# EAGLE design Zvonek (EAGLE 9.5.2)
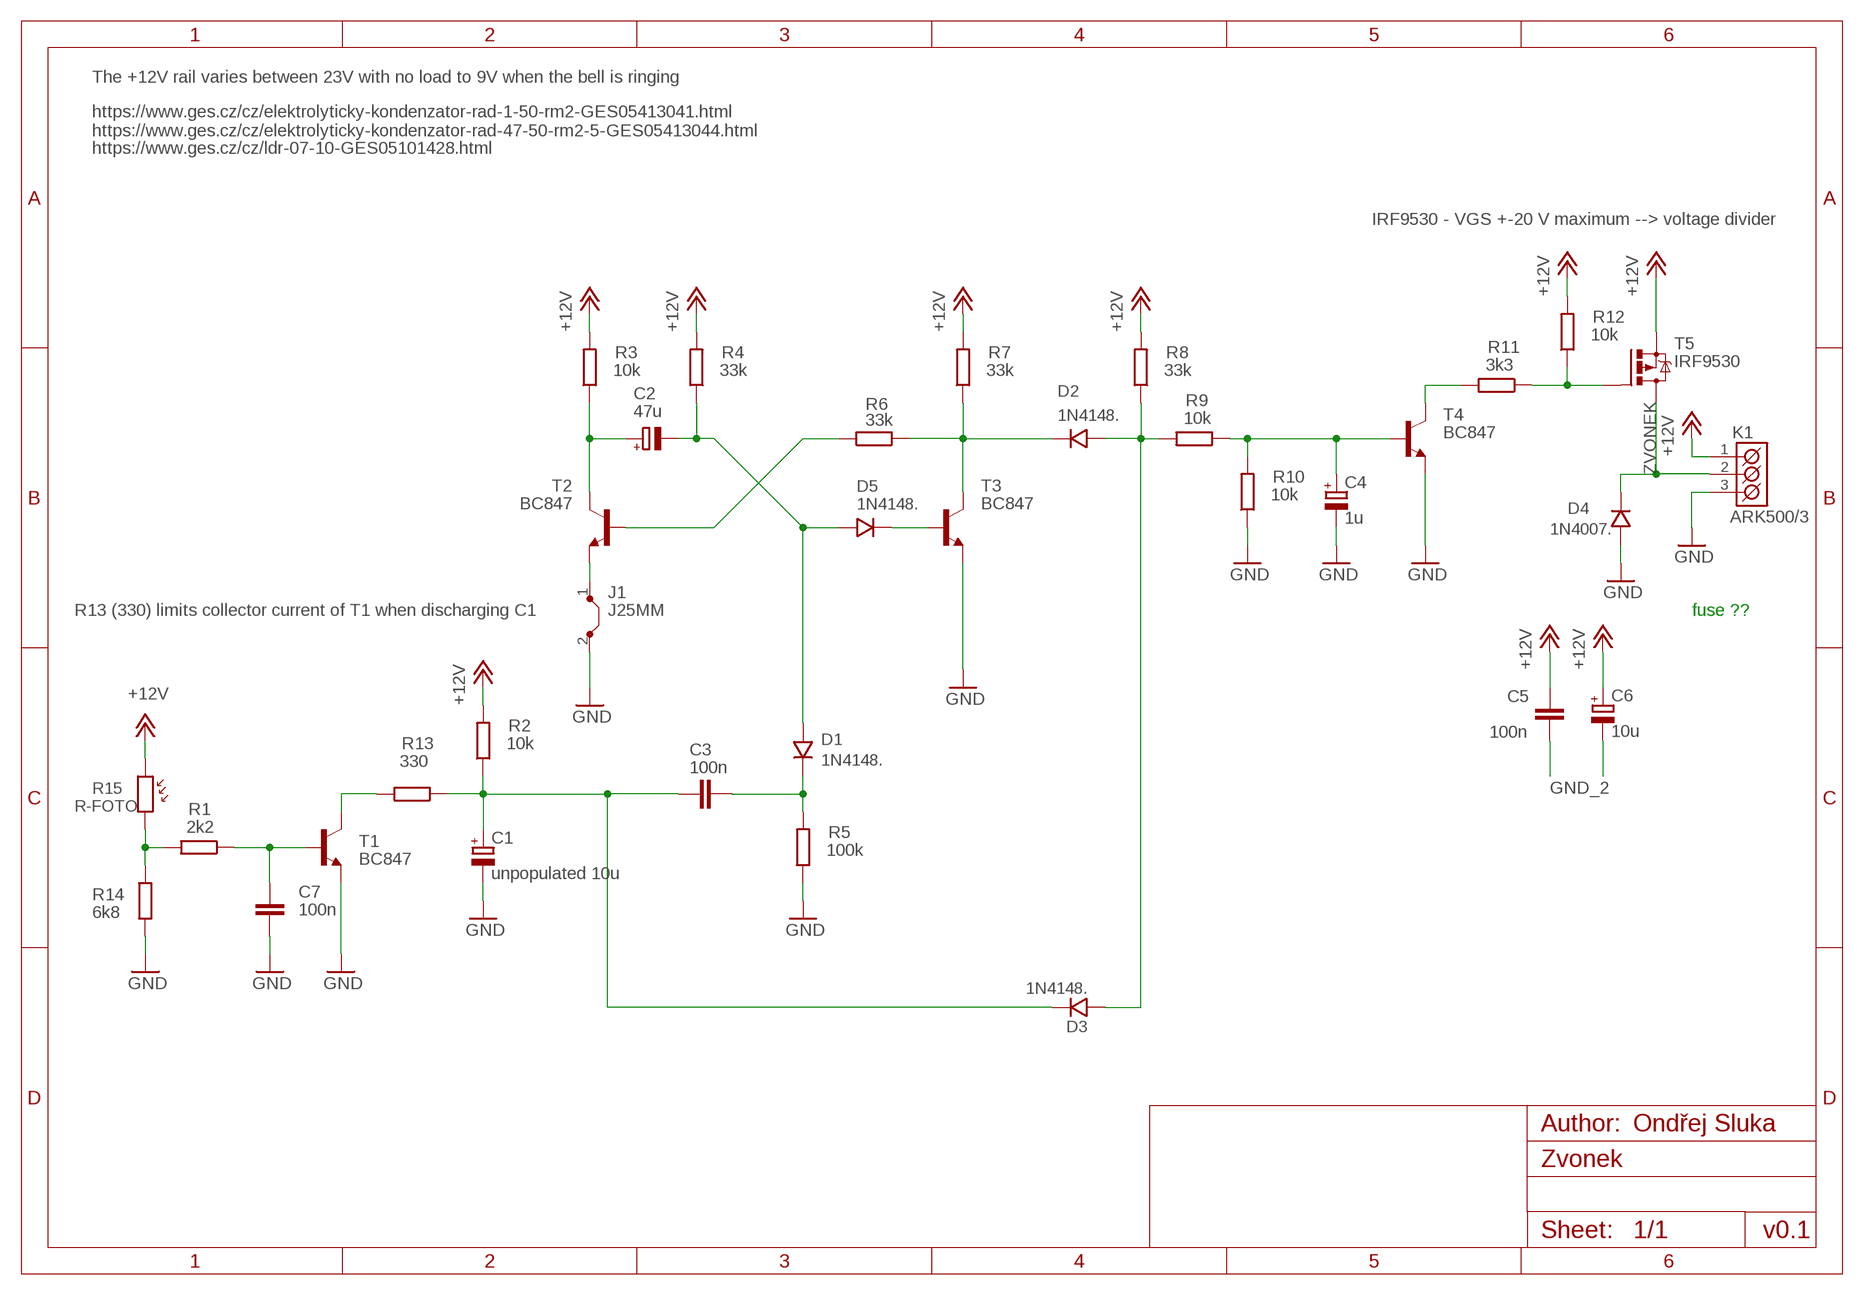
[diagram p0: schematic, sheet 1]
FRAME1 (A4L-LOC): AUTHOR: Ondřej Sluka; VERSION: v0.1

## Parts
C1  unpopulated 10u  CPOL-EUE2.5-5  [E2,5-5]
C2  47u  CPOL-EUE2.5-6  [E2,5-6]
C3  100n  C-EUC1206  [C1206]
C4  1u  CPOL-EUE2-5  [E2-5]
C5  100n  C-EUC1206  [C1206]
C6  10u  CPOL-EUE2.5-5  [E2,5-5]
C7  100n  C-EUC1206  [C1206]
D1  1N4148.  [SOD-80]
D2  1N4148.  [SOD-80]
D3  1N4148.  [SOD-80]
D4  1N4007.  [SM-1]
D5  1N4148.  [SOD-80]
J1  J25MM  [25]
K1  ARK500/3  [ARK500/3]
R1  2k2  R-EU_R1206  [R1206]
R2  10k  R-EU_R1206  [R1206]
R3  10k  R-EU_R1206  [R1206]
R4  33k  R-EU_R1206  [R1206]
R5  100k  R-EU_R1206  [R1206]
R6  33k  R-EU_R1206  [R1206]
R7  33k  R-EU_R1206  [R1206]
R8  33k  R-EU_R1206  [R1206]
R9  10k  R-EU_R1206  [R1206]
R10  10k  R-EU_R1206  [R1206]
R11  3k3  R-EU_R1206  [R1206]
R12  10k  R-EU_R1206  [R1206]
R13  330  R-EU_R1206  [R1206]
R14  6k8  R-EU_R1206  [R1206]
R15  R-FOTO  [R-FOTO]
T1  BC847  [SOT23]
T2  BC847  [SOT23]
T3  BC847  [SOT23]
T4  BC847  [SOT23]
T5  IRF9530  [TO220BV]

## Nets
+12V: C5.2 C6.+ K1.1(K1) R2.2 R3.2 R4.2 R7.2 R8.2 R12.2 R15.1 T5.S
GND: C1.- C4.- C7.1 D4.A J1.2 K1.3(K3) R5.1 R10.1 R14.2 T1.2(E) T3.2(E) T4.2(E)
GND_2: C5.1 C6.- J1.1 T2.2(E)
N$1: D2.K R6.2 R7.1 T3.3(C)
N$2: R6.1 T2.1(B)
N$3: C2.- D1.A D5.A R4.1
N$4: C2.+ R3.1 T2.3(C)
N$5: D2.A D3.A R8.1 R9.2
N$6: C3.2 D1.K R5.2
N$7: R13.2 T1.3(C)
N$8: C7.2 R1.1 T1.1(B)
N$9: C4.+ R9.1 R10.2 T4.1(B)
N$10: R11.2 T4.3(C)
N$11: R11.1 R12.1 T5.G
N$12: D5.K T3.1(B)
N$13: C1.+ C3.1 D3.K R2.1 R13.1
N$14: R1.2 R14.1 R15.2
ZVONEK: D4.K K1.2(K2) T5.D

## Notes on the sheet
- The +12V rail varies between 23V with no load to 9V when the bell is ringing
- https://www.ges.cz/cz/elektrolyticky-kondenzator-rad-1-50-rm2-GES05413041.html
  https://www.ges.cz/cz/elektrolyticky-kondenzator-rad-47-50-rm2-5-GES05413044.html
- https://www.ges.cz/cz/ldr-07-10-GES05101428.html
- IRF9530 - VGS +-20 V maximum --> voltage divider
- R13 (330) limits collector current of T1 when discharging C1 | fuse ??

## Library data of the parts
C1 C2 C4 C6 = rcl:CPOL-EU: POLARIZED CAPACITOR, European symbol; SPICEPREFIX: C
C3 C5 C7 = rcl:C-EU: CAPACITOR, European symbol; SPICEPREFIX: C
D1-D3 D5 = #PaJa_31_Edit:1N4148: Univerzalni dioda - 0,15A, 75V
D4 = #PaJa_31_Edit:1N4007: Usmernovaci dioda - 1A, 1000V
J1 = jumper:J: Bridge
K1 = #PaJa_konektory_edit:ARK500/3: Svorkovnice - roztec 5mm - trojita
R1-R14 = rcl:R-EU_: RESISTOR, European symbol; SPICEPREFIX: R
R15 = #PaJa_31_Edit:R-FOTO: Foto odpor
T1-T4 = transistor:BC847: NPN TRANSISTOR
T5 = transistor-power:IRF9530: P-CHANNEL HEXFET POWER-MOS-FET Source: http://www.irf.com/product-info/datasheets/data/irf9530.pdf

## Board
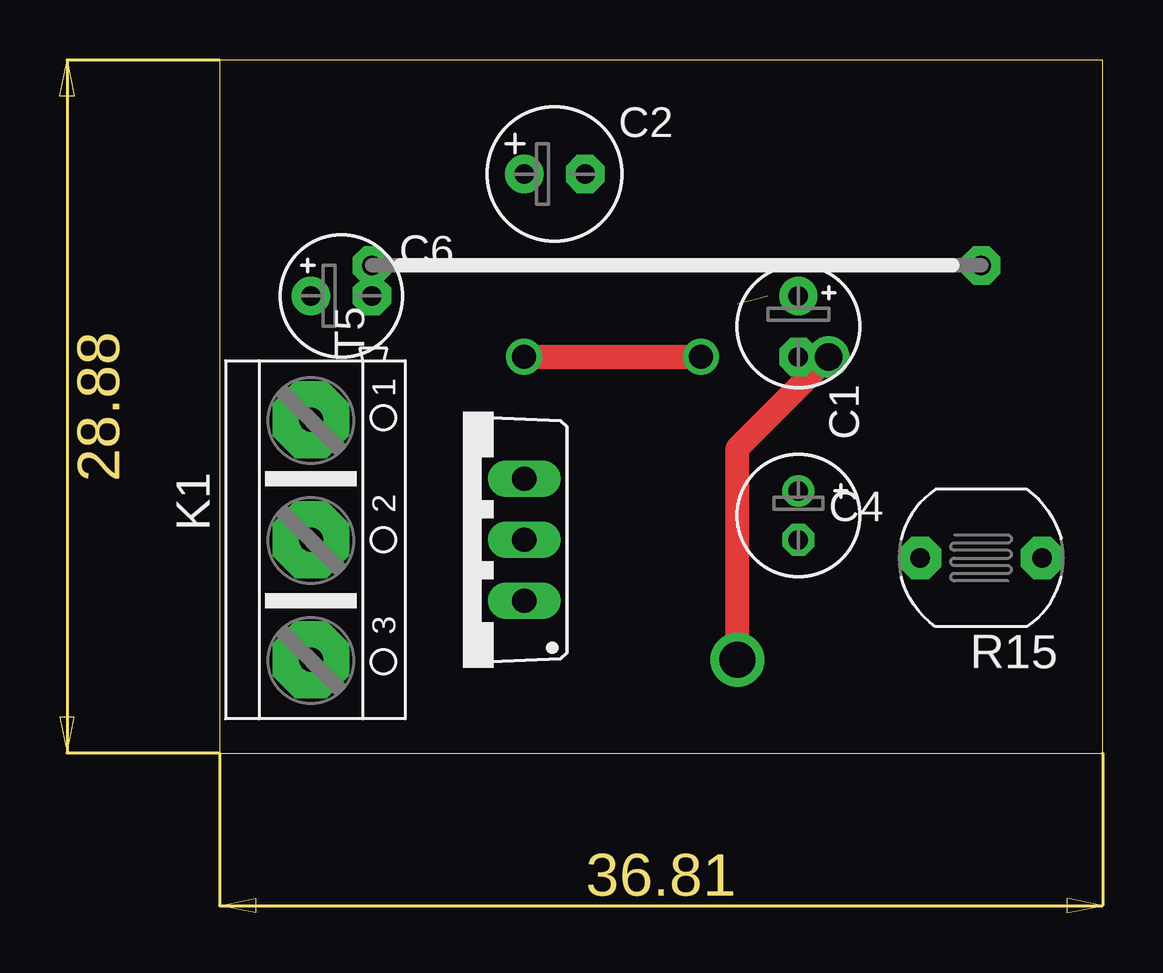
[diagram p1: board, top side]
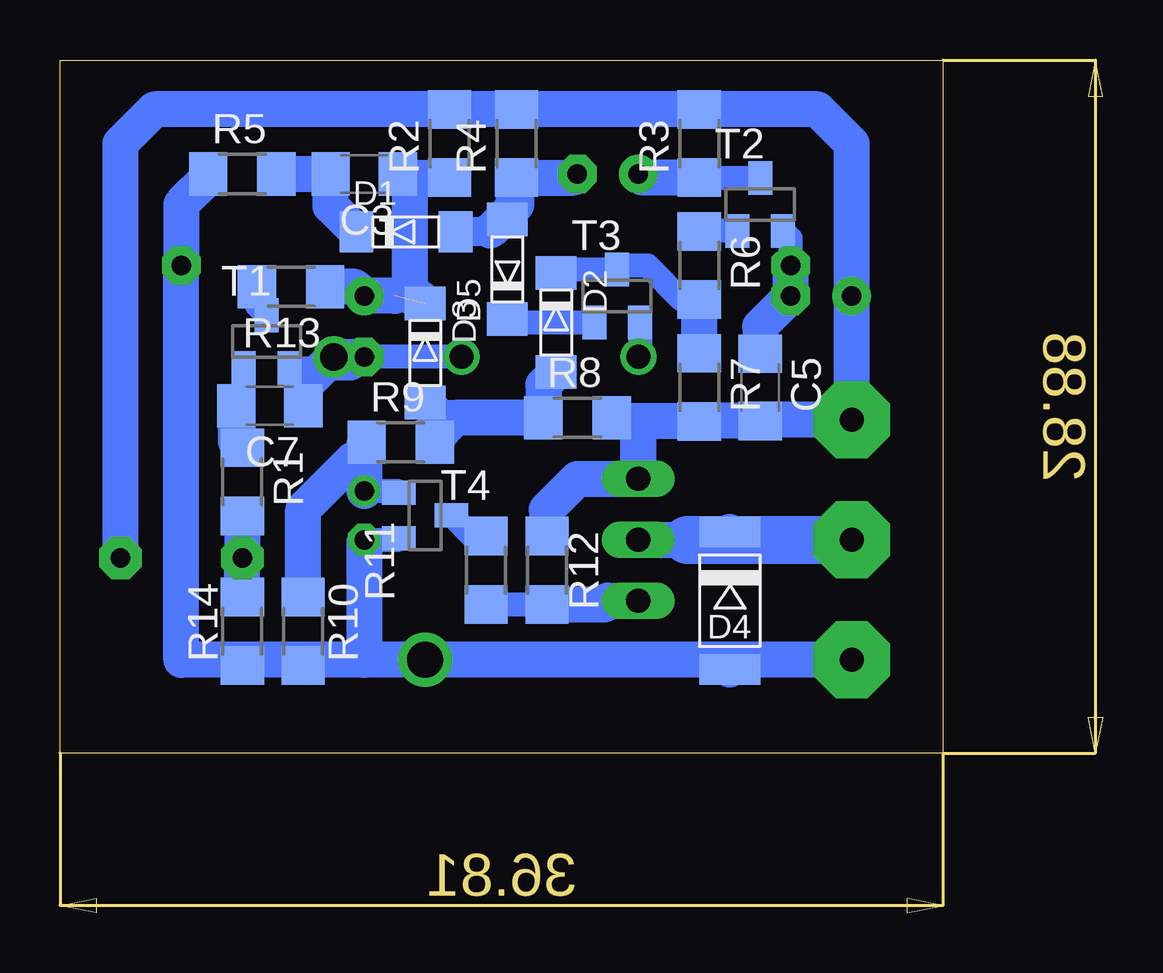
[diagram p2: board, bottom side, seen from below]

Size 36.81 x 28.88 mm. Coordinates in mm from the lower left corner, seen from the top.
Outline: 0,0 36.81,0 36.81,28.88 0,28.88 0,0
Copper layers (1*16): Top 0.035mm / dielectric 1.5mm / Bottom 0.035mm
Design rules "Freza1": minimum track width 0.5mm, minimum drill 0.8mm, track to track 0.4mm, track to pad 0.4mm, pad to pad 0.4mm, via to via 0.4mm, smd to smd 6mil, copper to edge 40mil, drill to drill 6mil, minimum pad ring 10mil, minimum via ring 8mil, stop-mask expansion 4mil, vias tented up to drill 0mil, thermal gap 10mil

### Footprints (pad centres in the part's own frame; a part is rotated, then mirrored left to right if it is on the bottom)
E2,5-5 = drill 0.813 pad 1.6: + -1.27,0 | drill 0.813 pad 1.6 octagon: - 1.27,0
E2,5-6 = drill 0.813 pad 1.6: + -1.27,0 | drill 0.813 pad 1.6 octagon: - 1.27,0
C1206 = smd 1.6 x 1.8: 1 -1.4,0; 2 1.4,0
E2-5 = drill 0.813 pad 1.27: + -1.016,0 | drill 0.813 pad 1.27 octagon: - 1.016,0
SOD-80 = smd 1.397 x 1.702: A 1.905,0; K -2.223,0
SM-1 = smd 1.27 x 2.54: A 2.857,0; K -2.857,0
25 = drill 0.813 pad 1.6 octagon: 1 -12.7,0; 2 12.7,0
ARK500/3 = drill 1 pad 3.2 octagon: 1 -5,0; 2 0,0; 3 5,0
R1206 = smd 1.6 x 1.803: 1 -1.422,0; 2 1.422,0
R-FOTO = drill 0.813 pad 1.778 octagon: 1 -2.54,0; 2 2.54,0
SOT23 = smd 1 x 1.4: 1 -0.95,-1.1; 2 0.95,-1.1; 3 0,1.1
TO220BV = drill 1.016 long: D 0,-2.54; G -2.54,-2.54; S 2.54,-2.54

### Placement (x,y rotation side)
C1  24.13,17.78 270 top
C2  13.97,24.13 0 top
C3  24.13,24.13 180 bottom
C4  24.13,9.91 270 top
C5  7.62,15.24 270 bottom
C6  5.08,19.05 0 top
C7  28.07,14.48 180 bottom
D1  22.23,21.72 0 bottom
D2  16.13,17.78 270 bottom
D3  21.59,16.51 270 bottom
D4  8.89,6.35 270 bottom
D5  18.16,20.32 90 bottom
J1  19.05,20.32 0 top
K1  3.81,8.89 270 top
R1  29.21,11.3 270 bottom
R2  20.57,25.4 90 bottom
R3  10.16,25.4 90 bottom
R4  17.78,25.4 90 bottom
R5  29.21,24.13 0 bottom
R6  10.16,20.32 270 bottom
R7  10.16,15.24 270 bottom
R8  15.24,13.97 0 bottom
R9  22.61,12.95 0 bottom
R10  26.67,5.08 90 bottom
R11  19.05,7.62 90 bottom
R12  16.51,7.62 90 bottom
R13  27.18,19.43 180 bottom
R14  29.21,5.08 270 bottom
R15  31.75,8.13 180 top
T1  28.19,17.14 0 bottom
T2  7.62,22.86 0 bottom
T3  13.59,19.05 0 bottom
T4  21.59,9.91 270 bottom
T5  10.16,8.89 90 top

### Tracks (layer width: path | path; a pad name or v marks a point on that pad's centre or on a via)
+12V
  Bottom 1.5: R12.2 16.51,10.16 15.24,11.43 T5.S 12.7,13.82 | R8.2 13.67,13.82 12.7,13.82 | 12.7,13.82 R7.2 10.14,13.84 C5.2 7.57,13.89 K1.1 C6.+ 3.81,25.4 5.23,26.82 R3.2 R4.2 R2.2 32.87,26.82 34.29,25.4 R15.1
GND  (via drill 1, 1.15, 1.5)
  Top 1: v21.59,3.89 21.59,12.7 v25.4,16.51 | v12.7,16.51 v20.07,16.51
  Bottom 1: T4.2 22.76,8.89 C4.- 24.13,8.76 | T1.2 24.59,16.05 C1.- v20.07,16.51 | T3.2 12.64,16.57 v12.7,16.51
  Bottom 1.5: K1.3 8.89,3.89 | 8.89,3.89 v21.59,3.89 24.13,3.89 | 24.13,3.89 26.44,3.89 | R5.1 30.63,23.98 31.75,22.86 J1.2 31.75,3.89 29.44,3.89 | D4.A 8.89,3.89 | R10.1 26.44,3.89 | 26.44,3.89 29.44,3.89 | C1.- v25.4,16.51 26.67,15.24 C7.1 | R14.2 29.44,3.89 | 24.13,8.76 24.13,3.89
GND_2
  Bottom 1: J1.1 6.35,21.44 T2.2
  Bottom 1.5: J1.1 C6.- 7.62,17.78 C5.1
N$1
  Bottom 1: D2.K 15.98,20.15 T3.3 13.42,20.32 12.32,20.32 10.9,18.9 R6.2
  Bottom 1.5: R7.1 R6.2
N$2
  Bottom 1: T2.1 10.14,21.76 R6.1
N$3
  Bottom 1: D1.A 20.32,21.64 | R4.1 18.16,23.6 D5.A
  Bottom 1.2: 18.87,21.77 18.92,21.72 D1.A
  Bottom 1.5: C2.- 15.39,23.98 R4.1 17.78,22.86 18.87,21.77
N$4
  Bottom 1: T2.3 10.14,23.96 R3.1
  Bottom 1.5: R3.1 12.55,23.98 C2.+
N$5
  Bottom 1.5: 20.32,13.97 R8.1 16.66,15.34 D2.A | R9.2 21.18,13.11 20.32,13.97 | D3.A 20.95,13.97 20.32,13.97
N$6
  Bottom 1.5: R5.2 C3.2 25.53,22.8 D1.K
N$7
  Bottom 1: R13.2 28.6,18.65 T1.3
N$8
  Bottom 1: T1.1 29.14,12.79 R1.1
  Bottom 1.5: R1.1 29.47,12.98 C7.2
N$9
  Bottom 1: C4.+ 22.76,10.92 T4.1
  Bottom 1.5: R9.1 24.13,12.85 24.13,12.22 | 24.13,12.22 C4.+ | R10.2 26.67,10.16 24.61,12.22 24.13,12.22
N$10
  Bottom 1: T4.3 19.63,9.04 R11.2
N$11
  Bottom 1: R11.1 R12.1 | 14.12,6.2 13.97,6.35
  Bottom 1.5: R12.1 14.12,6.2 | 13.97,6.35 T5.G
N$12
  Bottom 1: D5.K 18.01,17.95 T3.1
N$13  (1 unrouted)
  Bottom 1.5: D3.K 21.91,19.05 22.23,19.05 22.23,23.62 C3.1 22.58,23.98 R2.1 | 22.86,19.05 C1.+ 24.51,19.43 R13.1
N$14
  Bottom 1.5: R1.2 R15.2 R14.1
ZVONEK
  Bottom 1.5: T5.D 10.67,8.89 | D4.K 8.89,8.89
  Bottom 2: 10.67,8.89 8.89,8.89 K1.2